# EAGLE design dashboard (EAGLE 6.3)
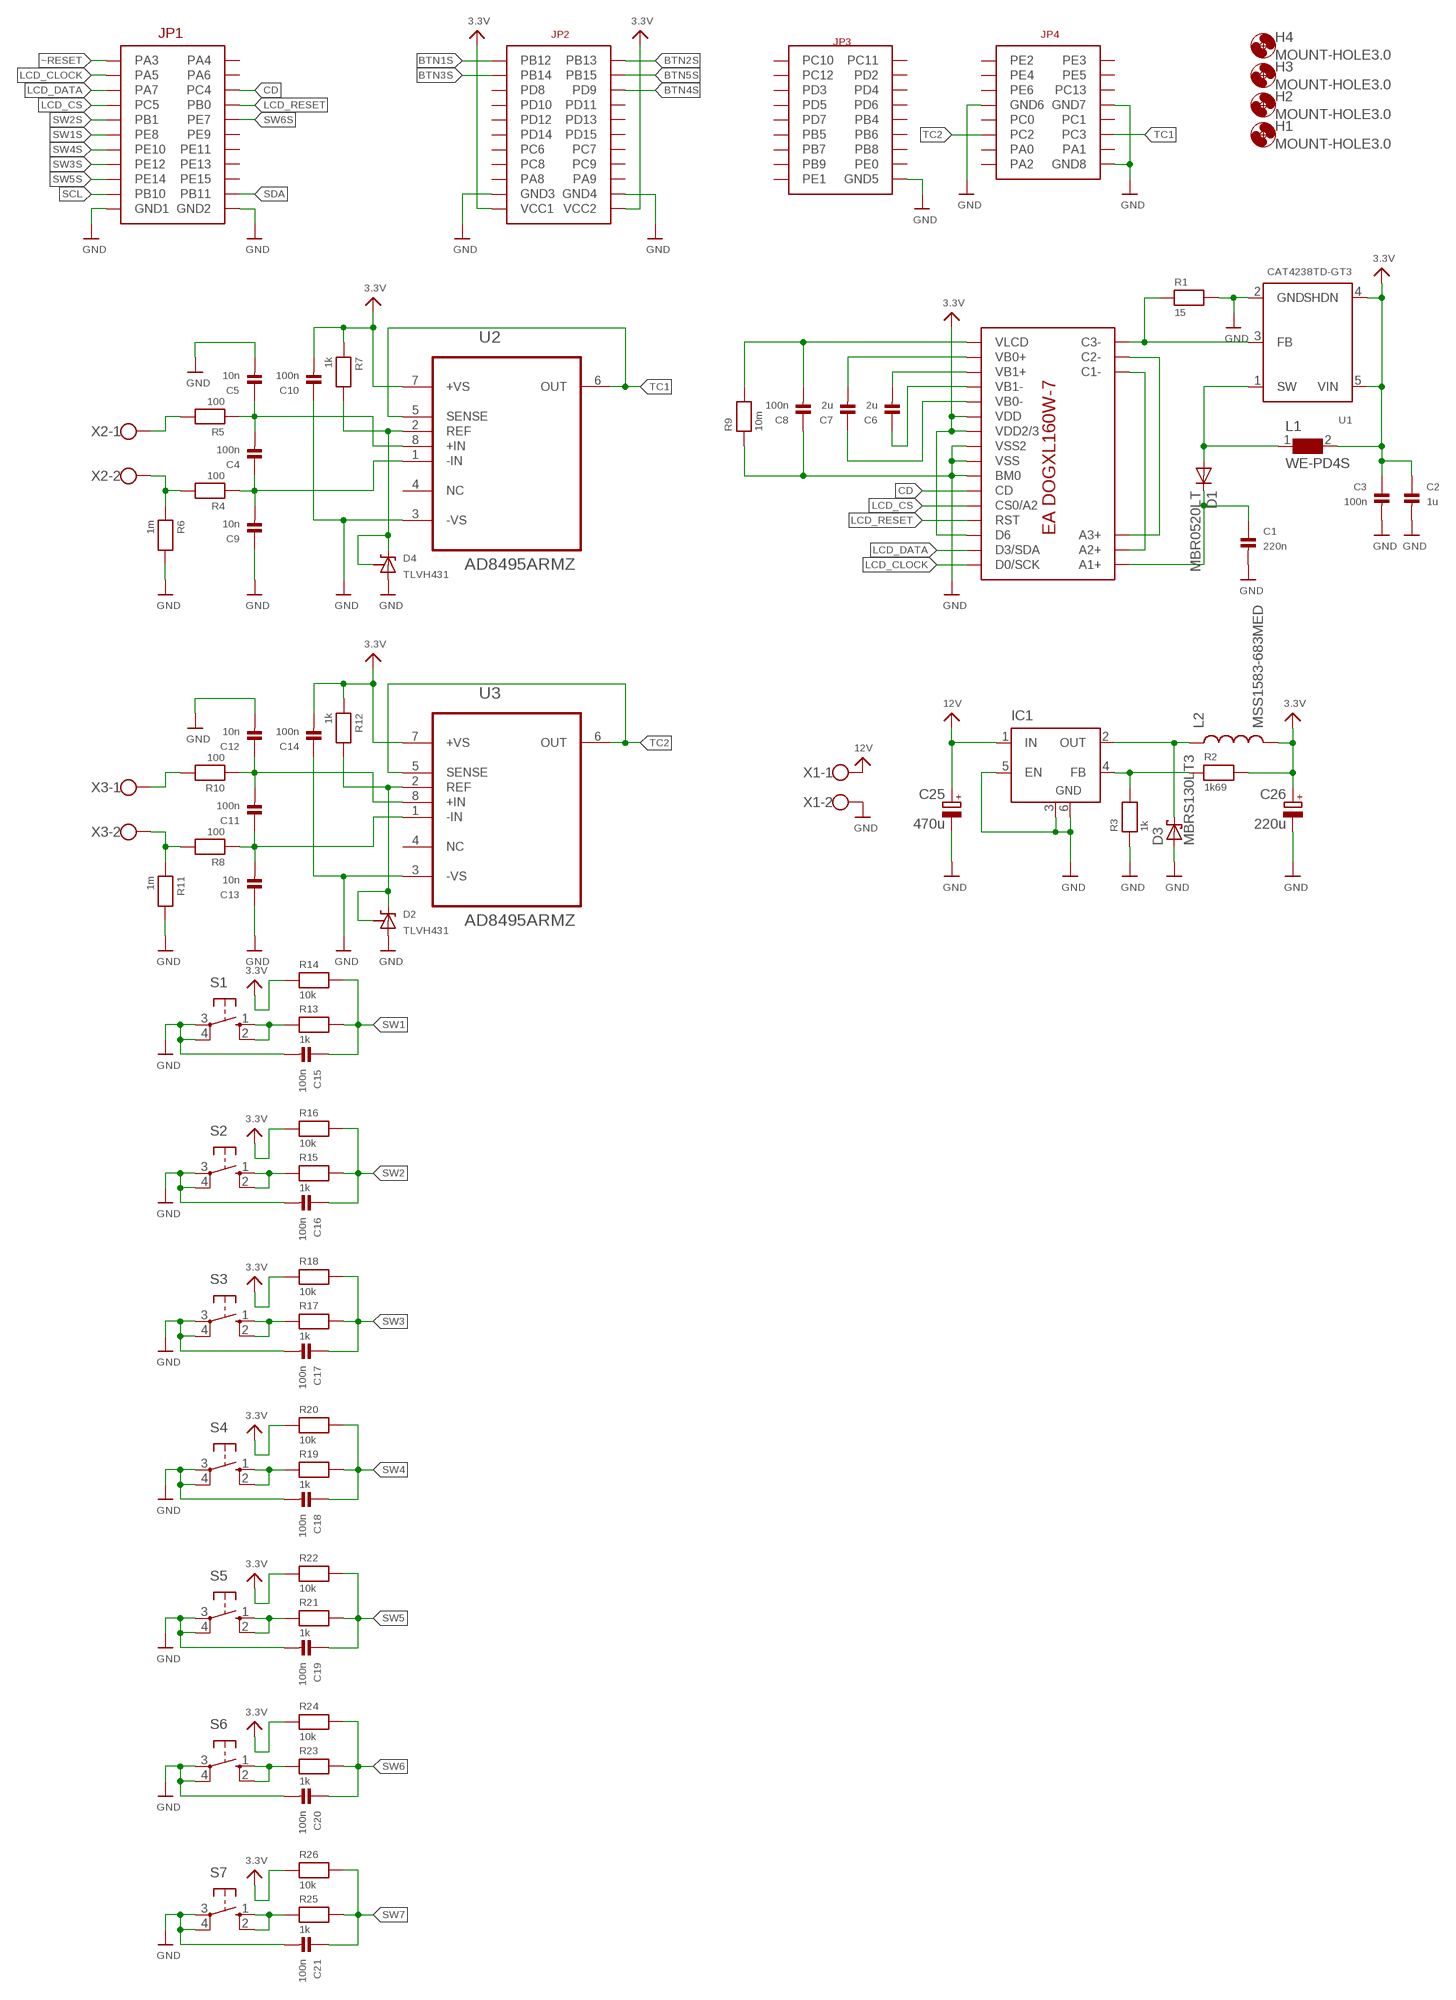
[diagram p0: schematic, sheet 1]

## Parts
C1  220n  CAP_CERAMIC_0805  [_0805]
C2  1u  CAP_CERAMIC_0805  [_0805]
C3  100n  CAP_CERAMIC_0603  [_0603]
C4  100n  CAP_CERAMIC_0603  [_0603]
C5  10n  CAP_CERAMIC_0603  [_0603]
C6  2u  CAP_CERAMIC_0805  [_0805]
C7  2u  CAP_CERAMIC_0805  [_0805]
C8  100n  CAP_CERAMIC_0603  [_0603]
C9  10n  CAP_CERAMIC_0603  [_0603]
C10  100n  CAP_CERAMIC_0603  [_0603]
C11  100n  CAP_CERAMIC_0603  [_0603]
C12  10n  CAP_CERAMIC_0603  [_0603]
C13  10n  CAP_CERAMIC_0603  [_0603]
C14  100n  CAP_CERAMIC_0603  [_0603]
C15  100n  CAP_CERAMIC_0603  [_0603]
C16  100n  CAP_CERAMIC_0603  [_0603]
C17  100n  CAP_CERAMIC_0603  [_0603]
C18  100n  CAP_CERAMIC_0603  [_0603]
C19  100n  CAP_CERAMIC_0603  [_0603]
C20  100n  CAP_CERAMIC_0603  [_0603]
C21  100n  CAP_CERAMIC_0603  [_0603]
C25  470u  CPOL-EU153CLV-1012  [153CLV-1012]
C26  220u  CPOL-EU153CLV-1012  [153CLV-1012]
D1  MBR0520LT  [SOD123]
D2  TLVH431  SHUNT-VREF  [SOT23-R]
D3  MBRS130LT3  [SMB]
D4  TLVH431  SHUNT-VREF  [SOT23-R]
H1  MOUNT-HOLE3.0  [3,0]
H2  MOUNT-HOLE3.0  [3,0]
H3  MOUNT-HOLE3.0  [3,0]
H4  MOUNT-HOLE3.0  [3,0]
IC1  LM2596S  [TO263-5]
L1  WE-PD4S  WE-PD4-7445501_S  [S]
L2  MSS1583-683MED  INDUCTORPWR  [CDRH125]
R1  15  RESISTOR_0603  [_0603]
R2  1k69  RESISTOR_0603  [_0603]
R3  1k  RESISTOR_0603  [_0603]
R4  100  RESISTOR_0603  [_0603]
R5  100  RESISTOR_0603  [_0603]
R6  1m  RESISTOR_0603  [_0603]
R7  1k  RESISTOR_0603  [_0603]
R8  100  RESISTOR_0603  [_0603]
R9  10m  RESISTOR_0805  [_0805]
R10  100  RESISTOR_0603  [_0603]
R11  1m  RESISTOR_0603  [_0603]
R12  1k  RESISTOR_0603  [_0603]
R13  1k  RESISTOR_0603  [_0603]
R14  10k  RESISTOR_0603  [_0603]
R15  1k  RESISTOR_0603  [_0603]
R16  10k  RESISTOR_0603  [_0603]
R17  1k  RESISTOR_0603  [_0603]
R18  10k  RESISTOR_0603  [_0603]
R19  1k  RESISTOR_0603  [_0603]
R20  10k  RESISTOR_0603  [_0603]
R21  1k  RESISTOR_0603  [_0603]
R22  10k  RESISTOR_0603  [_0603]
R23  1k  RESISTOR_0603  [_0603]
R24  10k  RESISTOR_0603  [_0603]
R25  1k  RESISTOR_0603  [_0603]
R26  10k  RESISTOR_0603  [_0603]
S1  10-XX  [B3F-10XX]
S2  10-XX  [B3F-10XX]
S3  10-XX  [B3F-10XX]
S4  10-XX  [B3F-10XX]
S5  10-XX  [B3F-10XX]
S6  10-XX  [B3F-10XX]
S7  10-XX  [B3F-10XX]
U1  CAT4238TD-GT3  FAN5331  [SOT23-5]
U2  AD8495ARMZ  [SOP65P490X110-8N]
U3  AD8495ARMZ  [SOP65P490X110-8N]
U$1  CPU-BOARD  [CPU-BOARD-JP1]
U$10  EA-DOGXL160W-7  [EA-DOGXL160W-7]
X1  W237-102  [W237-102]
X2  W237-102  [W237-102]
X3  W237-102  [W237-102]

## Nets
3.3V: C2.1 C3.1 C10.2 C14.2 C26.+ L1.2 L2.2 R2.2 R7.1 R12.1 R14.1 R16.1 R18.1 R20.1 R22.1 R24.1 R26.1 U1.4(SHDN) U1.5(VIN) U2.7(+VS) U3.7(+VS) U$1.P$43(VCC1) U$1.P$44(VCC2) U$10.P$22(VDD) U$10.P$23(VDD2/3) U$10.P$30(D6)
12V: C25.+ IC1.1(IN) X1.1
BTN1S: U$1.P$23(PB12)
BTN2S: U$1.P$24(PB13)
BTN3S: U$1.P$25(PB14)
BTN4S: U$1.P$28(PD9)
BTN5S: U$1.P$26(PB15)
CD: U$1.P$6(PC4) U$10.P$27(CD)
GND: C1.2 C2.2 C3.2 C5.2 C8.1 C9.1 C10.1 C12.2 C13.1 C14.1 C15.2 C16.2 C17.2 C18.2 C19.2 C20.2 C21.2 C25.- C26.- D2.3(A) D3.A D4.3(A) IC1.3(GND) IC1.5(EN) IC1.6(GND) R1.2 R3.1 R6.2 R9.1 R11.2 S1.3(P) S1.4(P1) S2.3(P) S2.4(P1) S3.3(P) S3.4(P1) S4.3(P) S4.4(P1) S5.3(P) S5.4(P1) S6.3(P) S6.4(P1) S7.3(P) S7.4(P1) U1.2(GND) U2.3(-VS) U3.3(-VS) U$1.P$19(GND1) U$1.P$20(GND2) U$1.P$41(GND3) U$1.P$42(GND4) U$1.P$62(GND5) U$1.P$69(GND6) U$1.P$70(GND7) U$1.P$78(GND8) U$10.P$24(VSS2) U$10.P$25(VSS) U$10.P$26(BM0) X1.2
LCD_CLOCK: U$1.P$3(PA5) U$10.P$32(D0/SCK)
LCD_CS: U$1.P$7(PC5) U$10.P$28(CS0/A2)
LCD_DATA: U$1.P$5(PA7) U$10.P$31(D3/SDA)
LCD_RESET: U$1.P$8(PB0) U$10.P$29(RST)
N$1: U$10.P$2(A2+) U$10.P$14(C1-)
N$2: U$10.P$3(A3+) U$10.P$15(C2-)
N$3: R1.1 U1.3(FB) U$10.P$16(C3-)
N$4: C1.1 D1.C U$10.P$1(A1+)
N$5: D1.A L1.1 U1.1(SW)
N$6: D3.C IC1.2(OUT) L2.1
N$7: D2.1(VREF) D2.2(C) R12.2 U3.2(REF)
N$8: R15.1 S2.1(S) S2.2(S1)
N$9: IC1.4(FB) R2.1 R3.2
N$10: D4.1(VREF) D4.2(C) R7.2 U2.2(REF)
N$11: R13.1 S1.1(S) S1.2(S1)
N$12: C4.1 C9.2 R4.1 U2.1(-IN)
N$13: C11.1 C13.2 R8.1 U3.1(-IN)
N$14: R4.2 R6.1 X2.2
N$15: R5.2 X2.1
N$16: C4.2 C5.1 R5.1 U2.8(+IN)
N$17: R8.2 R11.1 X3.2
N$18: R10.2 X3.1
N$19: C11.2 C12.1 R10.1 U3.8(+IN)
N$22: R17.1 S3.1(S) S3.2(S1)
N$24: R19.1 S4.1(S) S4.2(S1)
N$26: R21.1 S5.1(S) S5.2(S1)
N$28: R23.1 S6.1(S) S6.2(S1)
N$30: R25.1 S7.1(S) S7.2(S1)
N$57: C6.1 U$10.P$20(VB1-)
N$58: C7.1 U$10.P$21(VB0-)
N$59: C6.2 U$10.P$19(VB1+)
N$60: C7.2 U$10.P$18(VB0+)
N$61: C8.2 R9.2 U$10.P$17(VLCD)
SCL: U$1.P$21(PB10)
SDA: U$1.P$22(PB11)
SW1: C15.1 R13.2 R14.2
SW1S: U$1.P$11(PE8)
SW2: C16.1 R15.2 R16.2
SW2S: U$1.P$9(PB1)
SW3: C17.1 R17.2 R18.2
SW3S: U$1.P$15(PE12)
SW4: C18.1 R19.2 R20.2
SW4S: U$1.P$13(PE10)
SW5: C19.1 R21.2 R22.2
SW5S: U$1.P$17(PE14)
SW6: C20.1 R23.2 R24.2
SW6S: U$1.P$10(PE7)
SW7: C21.1 R25.2 R26.2
TC1: U2.5(SENSE) U2.6(OUT) U$1.P$74(PC3)
TC2: U3.5(SENSE) U3.6(OUT) U$1.P$73(PC2)
~RESET: U$1.P$1(PA3)
Unconnected: U2.4(NC) U3.4(NC) U$1.P$2(PA4) U$1.P$4(PA6) U$1.P$12(PE9) U$1.P$14(PE11) U$1.P$16(PE13) U$1.P$18(PE15) U$1.P$27(PD8) U$1.P$29(PD10) U$1.P$30(PD11) U$1.P$31(PD12) U$1.P$32(PD13) U$1.P$33(PD14) U$1.P$34(PD15) U$1.P$35(PC6) U$1.P$36(PC7) U$1.P$37(PC8) U$1.P$38(PC9) U$1.P$39(PA8) U$1.P$40(PA9) U$1.P$45(PC10) U$1.P$46(PC11) U$1.P$47(PC12) U$1.P$48(PD2) U$1.P$49(PD3) U$1.P$50(PD4) U$1.P$51(PD5) U$1.P$52(PD6) U$1.P$53(PD7) U$1.P$54(PB4) U$1.P$55(PB5) U$1.P$56(PB6) U$1.P$57(PB7) U$1.P$58(PB8) U$1.P$59(PB9) U$1.P$60(PE0) U$1.P$61(PE1) U$1.P$63(PE2) U$1.P$64(PE3) U$1.P$65(PE4) U$1.P$66(PE5) U$1.P$67(PE6) U$1.P$68(PC13) U$1.P$71(PC0) U$1.P$72(PC1) U$1.P$75(PA0) U$1.P$76(PA1) U$1.P$77(PA2)

## Library data of the parts
C1-C21 = microbuilder:CAP_CERAMIC: Ceramic Capacitors 0402 - 0402 Surface Mount Capacitors 16pF 50V 5% [Digikey: 445-4899-2-ND] 18pF 50V 5% [Digikey: 490-1281-2-ND] 22pF 50V 5% [Digikey: 490-1283-2-ND] 68pF 50V 5% [Digikey: 490-1289-2-ND] 0.1uF 10V 10% [Digikey: 490-1318-2-ND] 1.0uF 6.3V 10% [Digikey: 490-1320-2-ND] 0603 - 0603 Surface Mount Capacitors 16 pF 50V 5% [Digikey: 445-5051-2-ND] 22 pF 50V [Digikey: PCC220ACVTR-ND] 33 pF 50V 5% [Digikey: 490-1415-1-ND] 56pF 50V 5% [Digikey: 490-1421-1-ND] 220pF 50V 5% [Digikey: 445-1285-1-ND] 680 pF 50V 2200 pF 50V 5% C0G [Digikey: 445-1297-1-ND] 5600 pF 100V 5% X7R [Digikey: 478-3711-1-ND] 0.1 µF 25V 10% [Digikey: PCC2277TR-ND] 0.22 µF 16V 10% X7R [Digikey: 445-1318-1-ND] 1.0 µF 25V 10% [Digikey: 445-5146-2-ND] 0603 - RF Specific 3pF 250V +/-0.1pF RF [Digikey: 712-1347-1-ND] 18 pF 250V 5% [Digikey: 478-3505-1-ND or 712-1322-1-ND] 56 pF 250V 5% C0G RF [Digikey: 490-4867-1-ND] 68 pF 250V RF [Digikey: 490-4868-1-ND] 0805 - 0805 Surface Mount Capacitors 220 pF 250V 2% RF Ceramic Capacitor [Digikey: 712-1398-1-ND] 1000 pF 50V 2% NP0 Ceramic Capacitor [Digikey: 478-3760-1-ND] 0.1 µF 25V 10% Ceramic Capacitor [Digikey: PCC1828TR-ND] 1.0 µF 16V 10% Ceramic Capacitor[Digikey: 490-1691-2-ND] 10.0 µF 10V 10% Ceramic Capacitor[Digikey: 709-1228-1-ND] 10.0 uF 16V 10% Ceramic Capacitor [Digikey: 478-5165-2-ND] 47 uF 6.3V 20% Ceramic Capacitor [Digikey: 587-1779-1-ND or 399-5506-1-ND] 1206 - 1206 Surface Mount Capacitors 47uF 10V 20% Ceramic Capacitor [Digikey: 490-5528-1-ND or 399-5508-1-ND or 445-6010-1-ND] 100uF 6.3V -20%, +80% Y5V Ceramic Capacitor (Digikey: 490-4512-1-ND, Mouser: 81-GRM31CF50J107ZE1L)
C25 C26 = rcl:CPOL-EU: POLARIZED CAPACITOR, European symbol
D1 = diode:MBR0520LT: SCHOTTKY BARRIER RECTIFIER Source: http://onsemi.com .. MBR0520LT1-D.pdf
D2 D4 = microbuilder:SHUNT-VREF: Shunt Voltage Reference TS3431 - 1.24V Programmable Shunt Voltage Ref. - 1.24-24V, up to 0.25% accuracy, SOT23 (0.25% = Digikey: 497-4637-1-ND) TLVH431 - 1.24V Programmable Shunt Voltage Ref - 1.24-18V, up to 0.50% accuracy, SOT23 (0.50% = Digikey: 296-17687-1-ND See: http://www.ti.com/lit/an/slva445/slva445.pdf
D3 = diode:MBRS130LT3: Schottky Power Rectifier Source: http://www.onsemi.com/pub/Collateral/MBRS130LT3-D.PDF
H1-H4 = holes:MOUNT-HOLE: MOUNTING HOLE with drill center marker
IC1 = linear:LM2596S: STEP-DOWN VOLTAGE REGULATOR
L1 = WE-PD4:WE-PD4: SMD-Power Inductors WE-PD4 - Current loading up to 35 A - Compact size - Low-loss ferrite core - High storage capacity - Industry standardized size - Application frequency range up to 10 MHz -- Is recommended for the application with switching regulators from National Semiconductor, Linear Technology, Texas Instruments and Fairchild Semiconductor -- Noise suppression -- Perfectly suitable for switching regulators with extremely high efficiency; MPN: 7445501; OC_FARNELL: 1636112; OC_NEWARK: 08P2667; PACKAGE: Type S; SUPPLIER: Wuerth Elektronik
L2 = SparkFun-Passives:INDUCTOR: Inductors Basic Inductor/Choke - 0603 and 1206. Footprints are not proven and vary greatly between part numbers. INDUCTOR POWER 3.3UH 4.0A SMD 0.197" L x 0.197" W x 0.177" H (5.00mm x 5.00mm x 4.50mm)
R1-R26 = microbuilder:RESISTOR: Resistors 0402 - 0402 Surface Mount Package 22 Ohm 1% 1/16W [Digikey: 311-22.0LRTR-ND] 33 Ohm 5% 1/16W 1.0K 5% 1/16W 1.5K 5% 1/16W 2.0K 1% 1/16W 10.0K 1% 1/16W [Digikey: 311-10.0KLRTR-ND] 10.0K 5% 1/16W [Digikey: RMCF0402JT10K0TR-ND] 12.1K 1% 1/16W [Digikey: 311-22.0LRTR-ND] 100.0K 5% 1/16W 0603 - 0603 Surface Mount Package 0 Ohm 1/10 Watt 1% Resistor 15 Ohm 1/10 Watt 1% Resistor 33 Ohm 1/10 Watt 1% Resistor 49.9 Ohm 1/10 Watt 1% Resistor 100 Ohm 1/10 Watt 1% Resistor 150 Ohm 1/10 Watt 1% Resistor 240 Ohm 1/10 Watt 1% Resistor 390 Ohm 1/10 Watt 1% Resistor 560 Ohm 1/10 Watt 1% Resistor 680 Ohm 1/10 Watt 1% Resistor 750 Ohm 1/10 Watt 1% Resistor 1.0K Ohm 1/10 Watt 1% Resistor 1.5K Ohm 1/10 Watt 1% Resistor 2.0K Ohm 1/10 Watt 1% Resistor 2.2K Ohm 1/10 Watt 1% Resistor 3.3K Ohm 1/10 Watt 1% Resistor 4.7K Ohm 1/10 Watt 1% Resistor 10.0K Ohm 1/10 Watt 1% Resistor 12.0K Ohm 1/10 Watt 1% Resistor 12.1K Ohm 1/10 Watt 1% Resistor 20.0K Ohm 1/10 Watt 1% Resistor 33.0K Ohm 1/10 Watt 1% Resistor 100.0K Ohm 1/10 Watt 1% Resistor 0805 - 0805 Surface Mount Package 0 Ohm 1/8 Watt 1% Resistor 33 Ohm 1/8 Watt 1% Resistor 100 Ohm 1/8 Watt 1% Resistor 150 Ohm 1/8 Watt 1% Resistor 200 Ohm 1/8 Watt 1% Resistor 240 Ohm 1/8 Watt 1% Resistor 330 Ohm 1/8 Watt 1% Resistor 390 Ohm 1/8 Watt 1% Resistor 470 Ohm 1/8 Watt 1% Resistor 1.0K Ohm 1/8 Watt 1% Resistor 1.5K Ohm 1/8 Watt 1% Resistor 2.0K Ohm 1/8 Watt 1% Resistor 4.7K Ohm 1/8 Watt 1% Resistor 5.1K Ohm 1/8 Watt 1% Resistor 5.6K Ohm 1/8 Watt 1% Resistor 10.0K Ohm 1/8 Watt 1% Resistor 22.0K Ohm 1/8 Watt 1% Resistor 33.0K Ohm 1/8 Watt 1% Resistor 100K Ohm 1/8 Watt 1% Resistor 1206 - 1206 Surface Mount Package 2012 - 2010 Surface Mount Package 0.11 Ohm 1/2 Watt 1% Resistor - Digikey: RHM.11UCT-ND
S1-S7 = switch-omron:10-XX: OMRON SWITCH; MPN: B3F-1000; OC_FARNELL: 176432; OC_NEWARK: 36M3542
U1 = microbuilder:FAN5331: FAN5331 - LED/OLED 20V Boost Converter Digikey: FAN5331SXCT-ND
U2 U3 = Analog Devices_By_element14_Batch_1:AD8495ARMZ: Precision Thermocouple Amplifiers; MPN: AD8495ARMZ; OC_FARNELL: 1864707; OC_NEWARK: 85R6446; PACKAGE: MSOP-8; SUPPLIER: ANALOG DEVICES
U$1 = unicorn_v2:CPU-BOARD
U$10 = unicorn_v2:EA-DOGXL160W-7
X1-X3 = con-wago-500:W237-102: WAGO SCREW CLAMP; MPN: 237-102; OC_FARNELL: unknown; OC_NEWARK: 70K9898

## Board
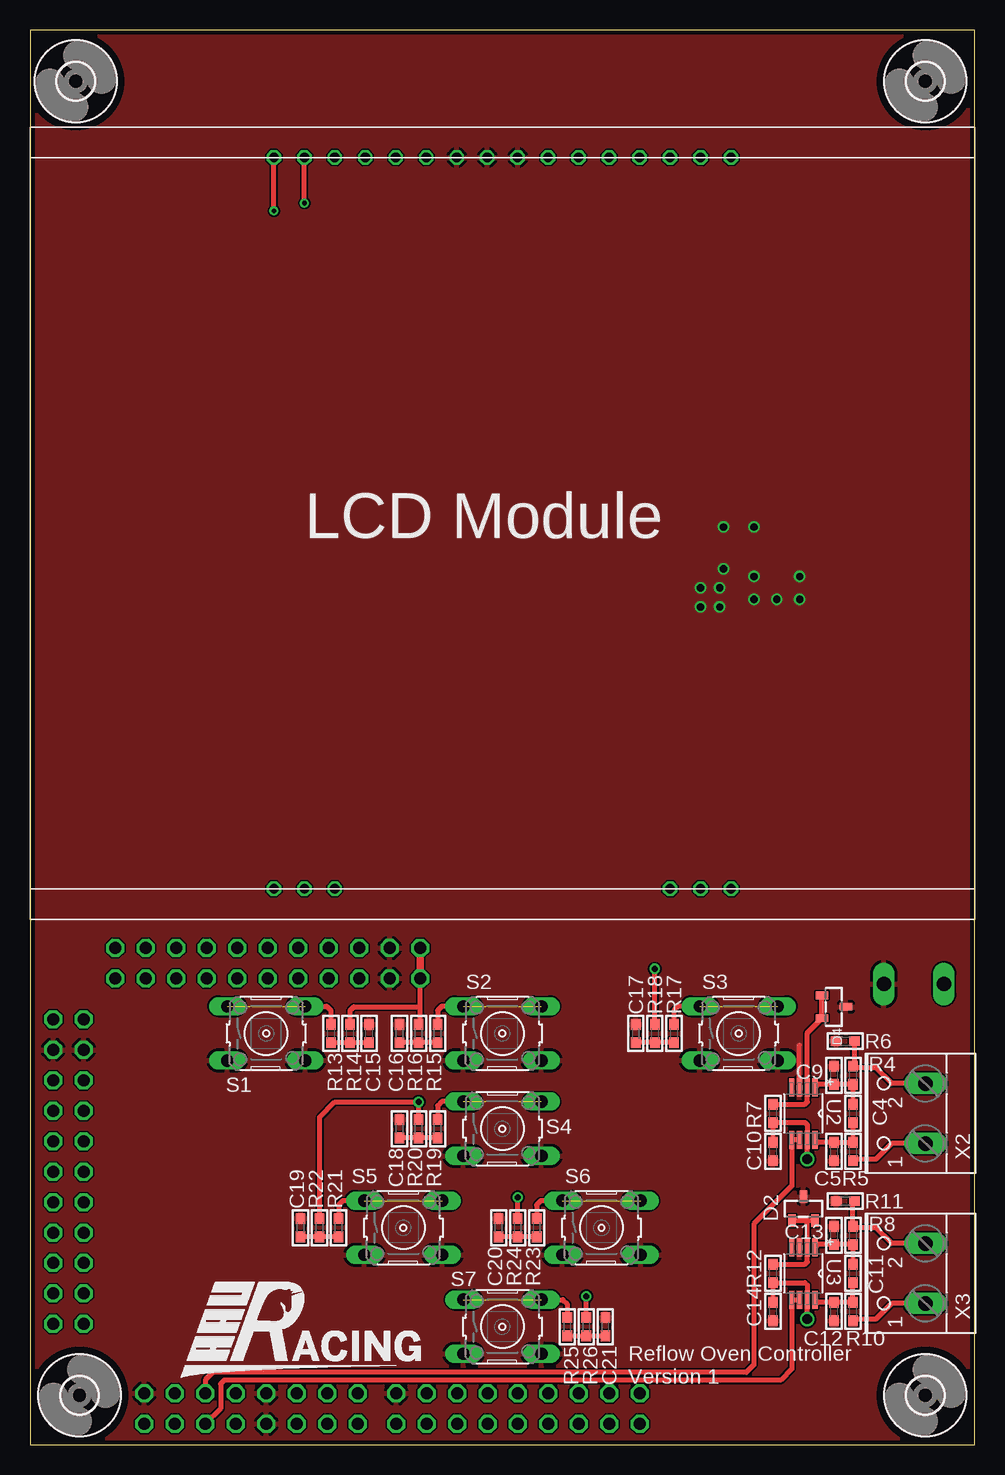
[diagram p1: board, top side]
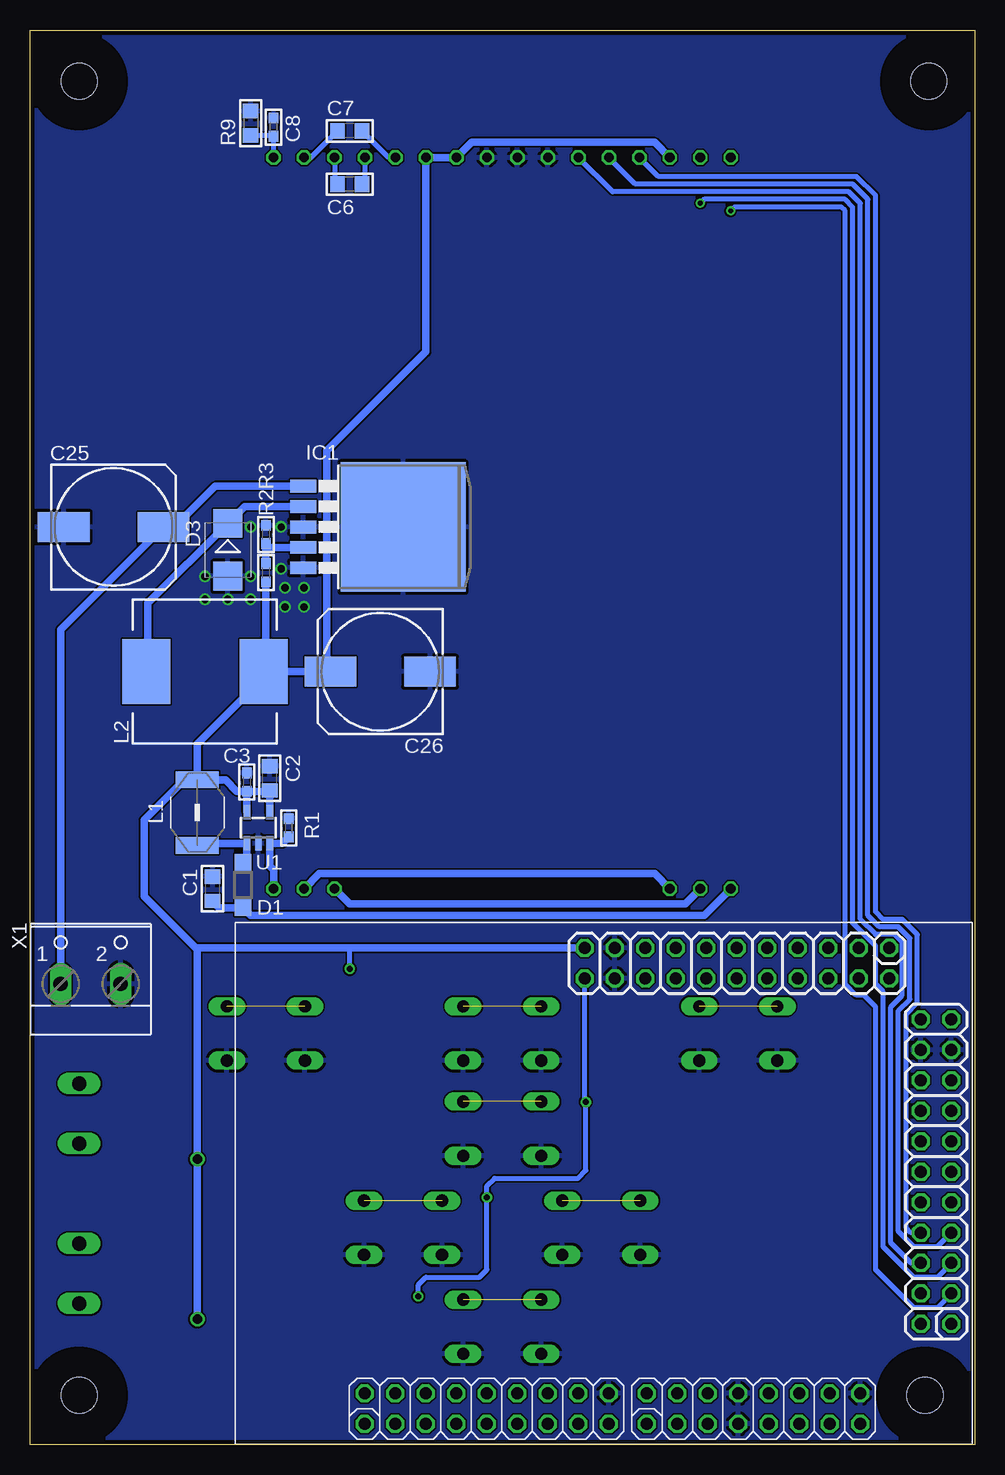
[diagram p2: board, bottom side, seen from below]

Size 78.72 x 117.94 mm. Coordinates in mm from the lower left corner, seen from the top.
Outline: 0,0 78.72,0 78.72,117.94 0,117.94 0,0
Copper layers (1*16): Top 0.0356mm / dielectric 1.5011mm / Bottom 0.0356mm
Design rules "LaenPCBOrder": minimum track width 6mil, minimum drill 13mil, track to track 6mil, track to pad 6mil, pad to pad 6mil, via to via 6mil, smd to smd 6mil, copper to edge 15mil, drill to drill 6mil, minimum pad ring 7mil, minimum via ring 7mil, stop-mask expansion 3mil, vias tented up to drill 0mil, thermal gap 10mil

### Footprints (pad centres in the part's own frame; a part is rotated, then mirrored left to right if it is on the bottom)
_0805 = smd 1.2 x 1.3: 1 -1.016,0; 2 1.016,0
_0603 = smd 0.9 x 0.8: 1 -0.762,0; 2 0.762,0
153CLV-1012 = smd 4.3 x 2.5: + 4.15,0; - -4.15,0
SOD123 = smd 1.4 x 1.4: A 1.9,0; C -1.9,0
SOT23-R = smd 0.635 x 1.016: 1 -0.95,-1; 2 0.95,-1; 3 0,1
SMB = smd 2.4 x 2.4: A 2.2,0; C -2.2,0
3,0 = hole 3: 0,0
TO263-5 = smd 1.067 x 2.159: 1 -3.404,-5.791; 2 -1.702,-5.791; 3 0,-5.791; 4 1.702,-5.791; 5 3.404,-5.791 | smd 10.8 x 10.41: 6 0,2.54
S = smd 1.4 x 3.56: 1 -2.73,0; 2 2.73,0
CDRH125 = smd 5.4 x 4: 1 0,4.9; 2 0,-4.9
B3F-10XX = drill 1.016 long: 1 -3.251,2.261; 2 3.251,2.261; 3 -3.251,-2.261; 4 3.251,-2.261
SOT23-5 = smd 0.55 x 1.2: 1 -0.95,-1.3; 2 0,-1.3; 3 0.95,-1.3; 4 0.95,1.3; 5 -0.95,1.3
SOP65P490X110-8N = smd 1.499 x 0.432: 1 -2.184,0.965; 2 -2.184,0.33; 3 -2.184,-0.33; 4 -2.184,-0.965; 5 2.184,-0.965; 6 2.184,-0.33; 7 2.184,0.33; 8 2.184,0.965
CPU-BOARD-JP1 = drill 1 octagon: P$1 1.27,-12.7; P$2 -1.27,-12.7; P$3 1.27,-10.16; P$4 -1.27,-10.16; P$5 1.27,-7.62; P$6 -1.27,-7.62; P$7 1.27,-5.08; P$8 -1.27,-5.08; P$9 1.27,-2.54; P$10 -1.27,-2.54; P$11 1.27,0; P$12 -1.27,0; P$13 1.27,2.54; P$14 -1.27,2.54; P$15 1.27,5.08; P$16 -1.27,5.08; P$17 1.27,7.62; P$18 -1.27,7.62; P$19 1.27,10.16; P$20 -1.27,10.16; P$21 1.27,12.7; P$22 -1.27,12.7; P$23 -3.905,18.637; P$24 -3.905,16.097; P$25 -6.445,18.637; P$26 -6.445,16.097; P$27 -8.985,18.637; P$28 -8.985,16.097; P$29 -11.525,18.637; P$30 -11.525,16.097; P$31 -14.065,18.637; P$32 -14.065,16.097; P$33 -16.605,18.637; P$34 -16.605,16.097; P$35 -19.145,18.637; P$36 -19.145,16.097; P$37 -21.685,18.637; P$38 -21.685,16.097; P$39 -24.225,18.637; P$40 -24.225,16.097; P$41 -26.765,18.637; P$42 -26.765,16.097; P$43 -29.305,18.637; P$44 -29.305,16.097; P$45 -47.625,-21.018; P$46 -47.625,-18.479; P$47 -45.085,-21.018; P$48 -45.085,-18.479; P$49 -42.545,-21.018; P$50 -42.545,-18.479; P$51 -40.005,-21.018; P$52 -40.005,-18.479; P$53 -37.465,-21.018; P$54 -37.465,-18.479; P$55 -34.925,-21.018; P$56 -34.925,-18.479; P$57 -32.385,-21.018; P$58 -32.385,-18.479; P$59 -29.845,-21.018; P$60 -29.845,-18.479; P$61 -27.305,-21.018; P$62 -27.305,-18.479; P$63 -24.115,-21.024; P$64 -24.115,-18.484; P$65 -21.575,-21.024; P$66 -21.575,-18.484; P$67 -19.035,-21.024; P$68 -19.035,-18.484; P$69 -16.495,-21.024; P$70 -16.495,-18.484; P$71 -13.955,-21.024; P$72 -13.955,-18.484; P$73 -11.415,-21.024; P$74 -11.415,-18.484; P$75 -8.875,-21.024; P$76 -8.875,-18.484; P$77 -6.335,-21.024; P$78 -6.335,-18.484
EA-DOGXL160W-7 = drill 0.8 octagon: P$1 20.32,2.54; P$2 22.86,2.54; P$3 25.4,2.54; P$14 53.34,2.54; P$15 55.88,2.54; P$16 58.42,2.54; P$17 58.42,63.5; P$18 55.88,63.5; P$19 53.34,63.5; P$20 50.8,63.5; P$21 48.26,63.5; P$22 45.72,63.5; P$23 43.18,63.5; P$24 40.64,63.5; P$25 38.1,63.5; P$26 35.56,63.5; P$27 33.02,63.5; P$28 30.48,63.5; P$29 27.94,63.5; P$30 25.4,63.5; P$31 22.86,63.5; P$32 20.32,63.5
W237-102 = drill 1.194 long: 1 -2.5,-1.27; 2 2.5,-1.27

### Placement (x,y rotation side)
C1  63.5,46.36 90 bottom
C2  58.74,55.56 90 bottom
C3  60.64,55.24 90 bottom
C4  68.58,27.62 270 top
C5  66.99,24.45 270 top
C6  52.07,105.09 180 bottom
C7  52.07,109.54 180 bottom
C8  58.42,109.85 270 bottom
C9  66.99,30.8 270 top
C10  61.91,24.45 90 top
C11  68.58,14.29 270 top
C12  66.99,11.11 270 top
C13  66.99,17.46 270 top
C14  61.91,11.11 90 top
C15  28.26,34.29 90 top
C16  30.8,34.29 90 top
C17  50.48,34.29 90 top
C18  30.8,26.35 90 top
C19  22.54,18.1 90 top
C20  39.05,18.1 90 top
C21  47.94,9.84 90 top
C25  71.76,76.52 0 bottom
C26  49.53,64.45 180 bottom
D1  60.96,46.67 90 bottom
D2  64.45,19.68 0 top
D3  62.23,74.61 270 bottom
D4  66.99,36.51 270 top
H1  4.13,4.13 0 top
H2  74.61,4.13 0 top
H3  74.61,113.66 0 top
H4  3.81,113.66 0 top
IC1  50.17,76.52 270 bottom
L1  64.77,52.7 90 bottom
L2  64.14,64.45 90 bottom
R1  57.15,51.44 90 bottom
R2  59.05,72.71 270 bottom
R3  59.05,75.88 270 bottom
R4  68.58,30.8 90 top
R5  68.58,24.45 270 top
R6  67.95,33.66 180 top
R7  61.91,27.62 90 top
R8  68.58,17.46 90 top
R9  60.33,110.17 270 bottom
R10  68.58,11.11 270 top
R11  67.95,20.32 180 top
R12  61.91,14.29 90 top
R13  25.08,34.29 270 top
R14  26.67,34.29 270 top
R15  33.97,34.29 270 top
R16  32.39,34.29 270 top
R17  53.66,34.29 270 top
R18  52.07,34.29 270 top
R19  33.97,26.35 270 top
R20  32.39,26.35 270 top
R21  25.72,18.1 270 top
R22  24.13,18.1 270 top
R23  42.23,18.1 270 top
R24  40.64,18.1 270 top
R25  44.77,9.84 270 top
R26  46.36,9.84 270 top
S1  19.69,34.29 0 top
S2  39.37,34.29 0 top
S3  59.05,34.29 0 top
S4  39.37,26.35 0 top
S5  31.11,18.1 0 top
S6  47.63,18.1 0 top
S7  39.37,9.84 0 top
U1  59.69,51.44 0 bottom
U2  64.45,27.62 270 top
U3  64.45,14.29 270 top
U$1  3.2,22.77 0 bottom
U$10  0,43.81 0 top
X1  73.66,39.69 0 bottom
X2  73.34,27.62 90 top
X3  73.34,14.29 90 top

### Tracks (layer width: path | path; a pad name or v marks a point on that pad's centre or on a via)
3.3V  (via drill 0.5, 0.8)
  Top 0.406: C10.2 R7.1 64.58,26.86 64.78,26.66 U2.7 64.77,25.43 v64.77,23.81 | C14.2 R12.1 64.58,13.53 64.78,13.32 U3.7 64.77,12.09 v64.77,10.48 | R14.1 26.67,36.19 26.99,36.51 32.51,36.51 | 32.51,36.51 32.51,35.05 R16.1 | 32.51,36.51 U$1.P$44 | R18.1 v52.07,39.69 | R20.1 v32.39,28.58 25.4,28.58 24.13,27.31 R22.1 | R24.1 v40.64,20.64 | R26.1 v46.35,12.38
  Top 0.61: U$1.P$44 U$1.P$43
  Bottom 0.406: v52.07,39.69 52.07,41.41 | U$1.P$44 32.51,28.7 v32.39,28.58 32.39,22.86 33.02,22.22 40.01,22.22 40.64,21.59 v40.64,20.64 40.64,14.6 41.27,13.97 45.72,13.97 46.35,13.33 v46.35,12.38
  Bottom 0.61: U1.4 C2.1 58.8,54.48 C3.1 | U1.5 C3.1 | C3.1 61.47,54.48 62.42,55.43 64.14,55.43 | 64.14,55.43 L1.2 64.77,58.42 59.23,63.95 L2.2 | R2.2 59.05,64.63 L2.2 | L2.2 C26.+ 53.98,64.75 53.98,82.87 45.72,91.12 U$10.P$22 U$10.P$23 41.91,108.59 26.67,108.59 U$10.P$30 | U$1.P$43 52.07,41.41 64.77,41.41 | 64.77,41.41 64.9,41.41 69.22,45.72 69.22,52.07 66.04,55.24 64.32,55.24 64.14,55.43 | v64.77,10.48 v64.77,23.81 64.77,41.41
12V
  Bottom 0.61: X1.1 76.16,67.96 C25.+ 66.67,76.52 63.27,79.92 IC1.1
CD
  Bottom 0.406: U$1.P$6 5.31,15.15 6.98,16.83 6.98,36.51 6.03,37.47 6.03,41.91 6.67,42.54 8.26,42.54 9.53,43.81 9.53,103.51 10.48,104.46 30.16,104.46 U$10.P$27
GND  (via drill 0.6)
  Top 0.406: U2.3 64.12,33.32 64.14,33.34
  other vias: 55.88,71.44 57.47,71.44 57.79,73.03 57.79,76.52 60.33,76.52 60.33,70.48 62.23,70.48 64.14,70.48 64.14,72.39 60.33,72.39 57.47,69.85 55.88,69.85
  pour Top: 0,0 78.74,0 78.74,117.79 0,117.79
  pour Bottom: 0,0 78.74,0 78.74,117.79 0,117.79
LCD_CLOCK  (via drill 0.38)
  Top 0.406: v20.32,102.87 U$10.P$32
  Bottom 0.406: U$1.P$3 3.11,11.43 5.08,11.43 8.26,14.6 8.26,36.51 9.21,37.47 9.84,37.47 10.79,38.42 10.79,102.87 11.11,103.19 20,103.19 v20.32,102.87
LCD_CS
  Bottom 0.406: U$1.P$7 3.11,16.51 5.08,16.51 6.35,17.78 6.35,36.19 5.4,37.15 5.4,42.23 6.35,43.18 7.94,43.18 8.89,44.13 8.89,103.82 10.16,105.09 28.26,105.09 U$10.P$28
LCD_DATA  (via drill 0.38)
  Top 0.406: v22.86,103.51 U$10.P$31
  Bottom 0.406: U$1.P$5 3.11,13.97 5.08,13.97 7.62,16.51 7.62,37.78 8.26,38.42 8.26,41.59 10.16,43.5 10.16,103.19 10.79,103.82 22.54,103.82 v22.86,103.51
LCD_RESET
  Bottom 0.406: U$1.P$8 5.31,17.69 5.71,18.1 5.71,35.88 4.76,36.83 4.76,42.54 6.03,43.81 7.62,43.81 8.26,44.45 8.26,104.14 9.84,105.73 26.35,105.73 U$10.P$29
N$1
  Bottom 0.61: U$10.P$2 24.13,45.09 52.07,45.09 U$10.P$14
N$2
  Bottom 0.61: U$10.P$15 54.61,47.63 26.67,47.63 U$10.P$3
N$3
  Bottom 0.61: R1.1 57.69,50.13 U1.3 58.74,48.26 58.42,47.94 U$10.P$16
N$4
  Bottom 0.61: C1.1 62.93,44.77 D1.C 60.32,44.13 22.54,44.13 U$10.P$1
N$5
  Bottom 0.61: D1.A 60.64,48.89 U1.1 64.61,50.13 L1.1
N$6
  Bottom 0.61: IC1.2 60.82,78.22 D3.C 62.25,76.81 68.9,70.17 68.9,64.59 L2.1
N$7
  Top 0.406: R12.2 64.58,15.05 64.78,15.25 U3.2 64.77,16.48 64.77,18.68 | D2.2 64.77,18.68 | 64.77,18.68 D2.1
N$8  (1 unrouted)
  Top 0.406: S2.1 34.33,36.55 33.97,36.19 R15.1
N$9
  Bottom 0.61: IC1.4 58.75,74.82 R3.2 R2.1
N$10
  Top 0.406: R7.2 64.58,28.38 64.78,28.59 U2.2 64.78,34.35 D4.2 D4.1
N$11  (1 unrouted)
  Top 0.406: S1.2 24.73,36.55 25.08,36.19 R13.1
N$12
  Top 0.406: C4.1 R4.1 C9.2 65.65,30.04 U2.1
N$13
  Top 0.406: C11.1 R8.1 C13.2 65.65,16.7 U3.1
N$14
  Top 0.406: X2.2 71.79,30.12 70.48,31.43 68.71,31.43 R4.2 68.71,31.69 R6.1
N$15
  Top 0.406: X2.1 71.79,25.12 70.48,23.81 68.71,23.81 R5.2
N$16
  Top 0.406: C4.2 R5.1 C5.1 65.65,25.21 U2.8
N$17
  Top 0.406: X3.2 71.79,16.79 70.48,18.1 68.71,18.1 R8.2 68.58,20.19 R11.1
N$18
  Top 0.406: X3.1 71.79,11.79 70.48,10.48 68.71,10.48 R10.2
N$19
  Top 0.406: C11.2 R10.1 C12.1 65.65,11.87 U3.8
N$22  (1 unrouted)
  Top 0.406: S3.1 54.01,36.55 53.66,36.19 R17.1
N$24  (1 unrouted)
  Top 0.406: S4.1 34.33,28.61 33.97,28.26 R19.1
N$26  (1 unrouted)
  Top 0.406: S5.1 26.07,20.36 25.72,20 R21.1
N$28  (1 unrouted)
  Top 0.406: S6.1 42.58,20.36 42.23,20 R23.1
N$30  (1 unrouted)
  Top 0.406: S7.2 44.41,12.1 44.77,11.75 R25.1
N$57
  Bottom 0.406: U$10.P$20 50.8,105.35 C6.1
N$58
  Bottom 0.406: U$10.P$21 48.83,107.32 C7.1
N$59
  Bottom 0.406: U$10.P$19 53.34,105.35 C6.2
N$60
  Bottom 0.406: U$10.P$18 55.31,107.32 C7.2
N$61
  Bottom 0.406: U$10.P$17 C8.2 58.48,109.16 R9.2
SW1
  Top 0.406: R13.2 R14.2 C15.1
SW2
  Top 0.406: R15.2 R16.2 C16.1
SW3
  Top 0.406: R17.2 R18.2 C17.1
SW4
  Top 0.406: R19.2 R20.2 C18.1
SW5
  Top 0.406: R21.2 R22.2 C19.1
SW6
  Top 0.406: R23.2 R24.2 C20.1
SW7
  Top 0.406: R25.2 R26.2 C21.1
TC1
  Top 0.406: U2.6 U2.5 63.49,21.58 60.32,18.41 60.32,6.67 59.69,6.03 15.24,6.03 14.62,5.41 U$1.P$74
TC2
  Top 0.406: U3.6 U3.5 63.49,6.34 62.55,5.4 16.19,5.4 15.87,5.08 15.87,3.01 U$1.P$73

### Text on the board
_tsilk: Reflow Oven Controller / Version 1